# Altium schematic sheet P11 Peripheral of Hi351.SchDoc
size 420 x 297 mm
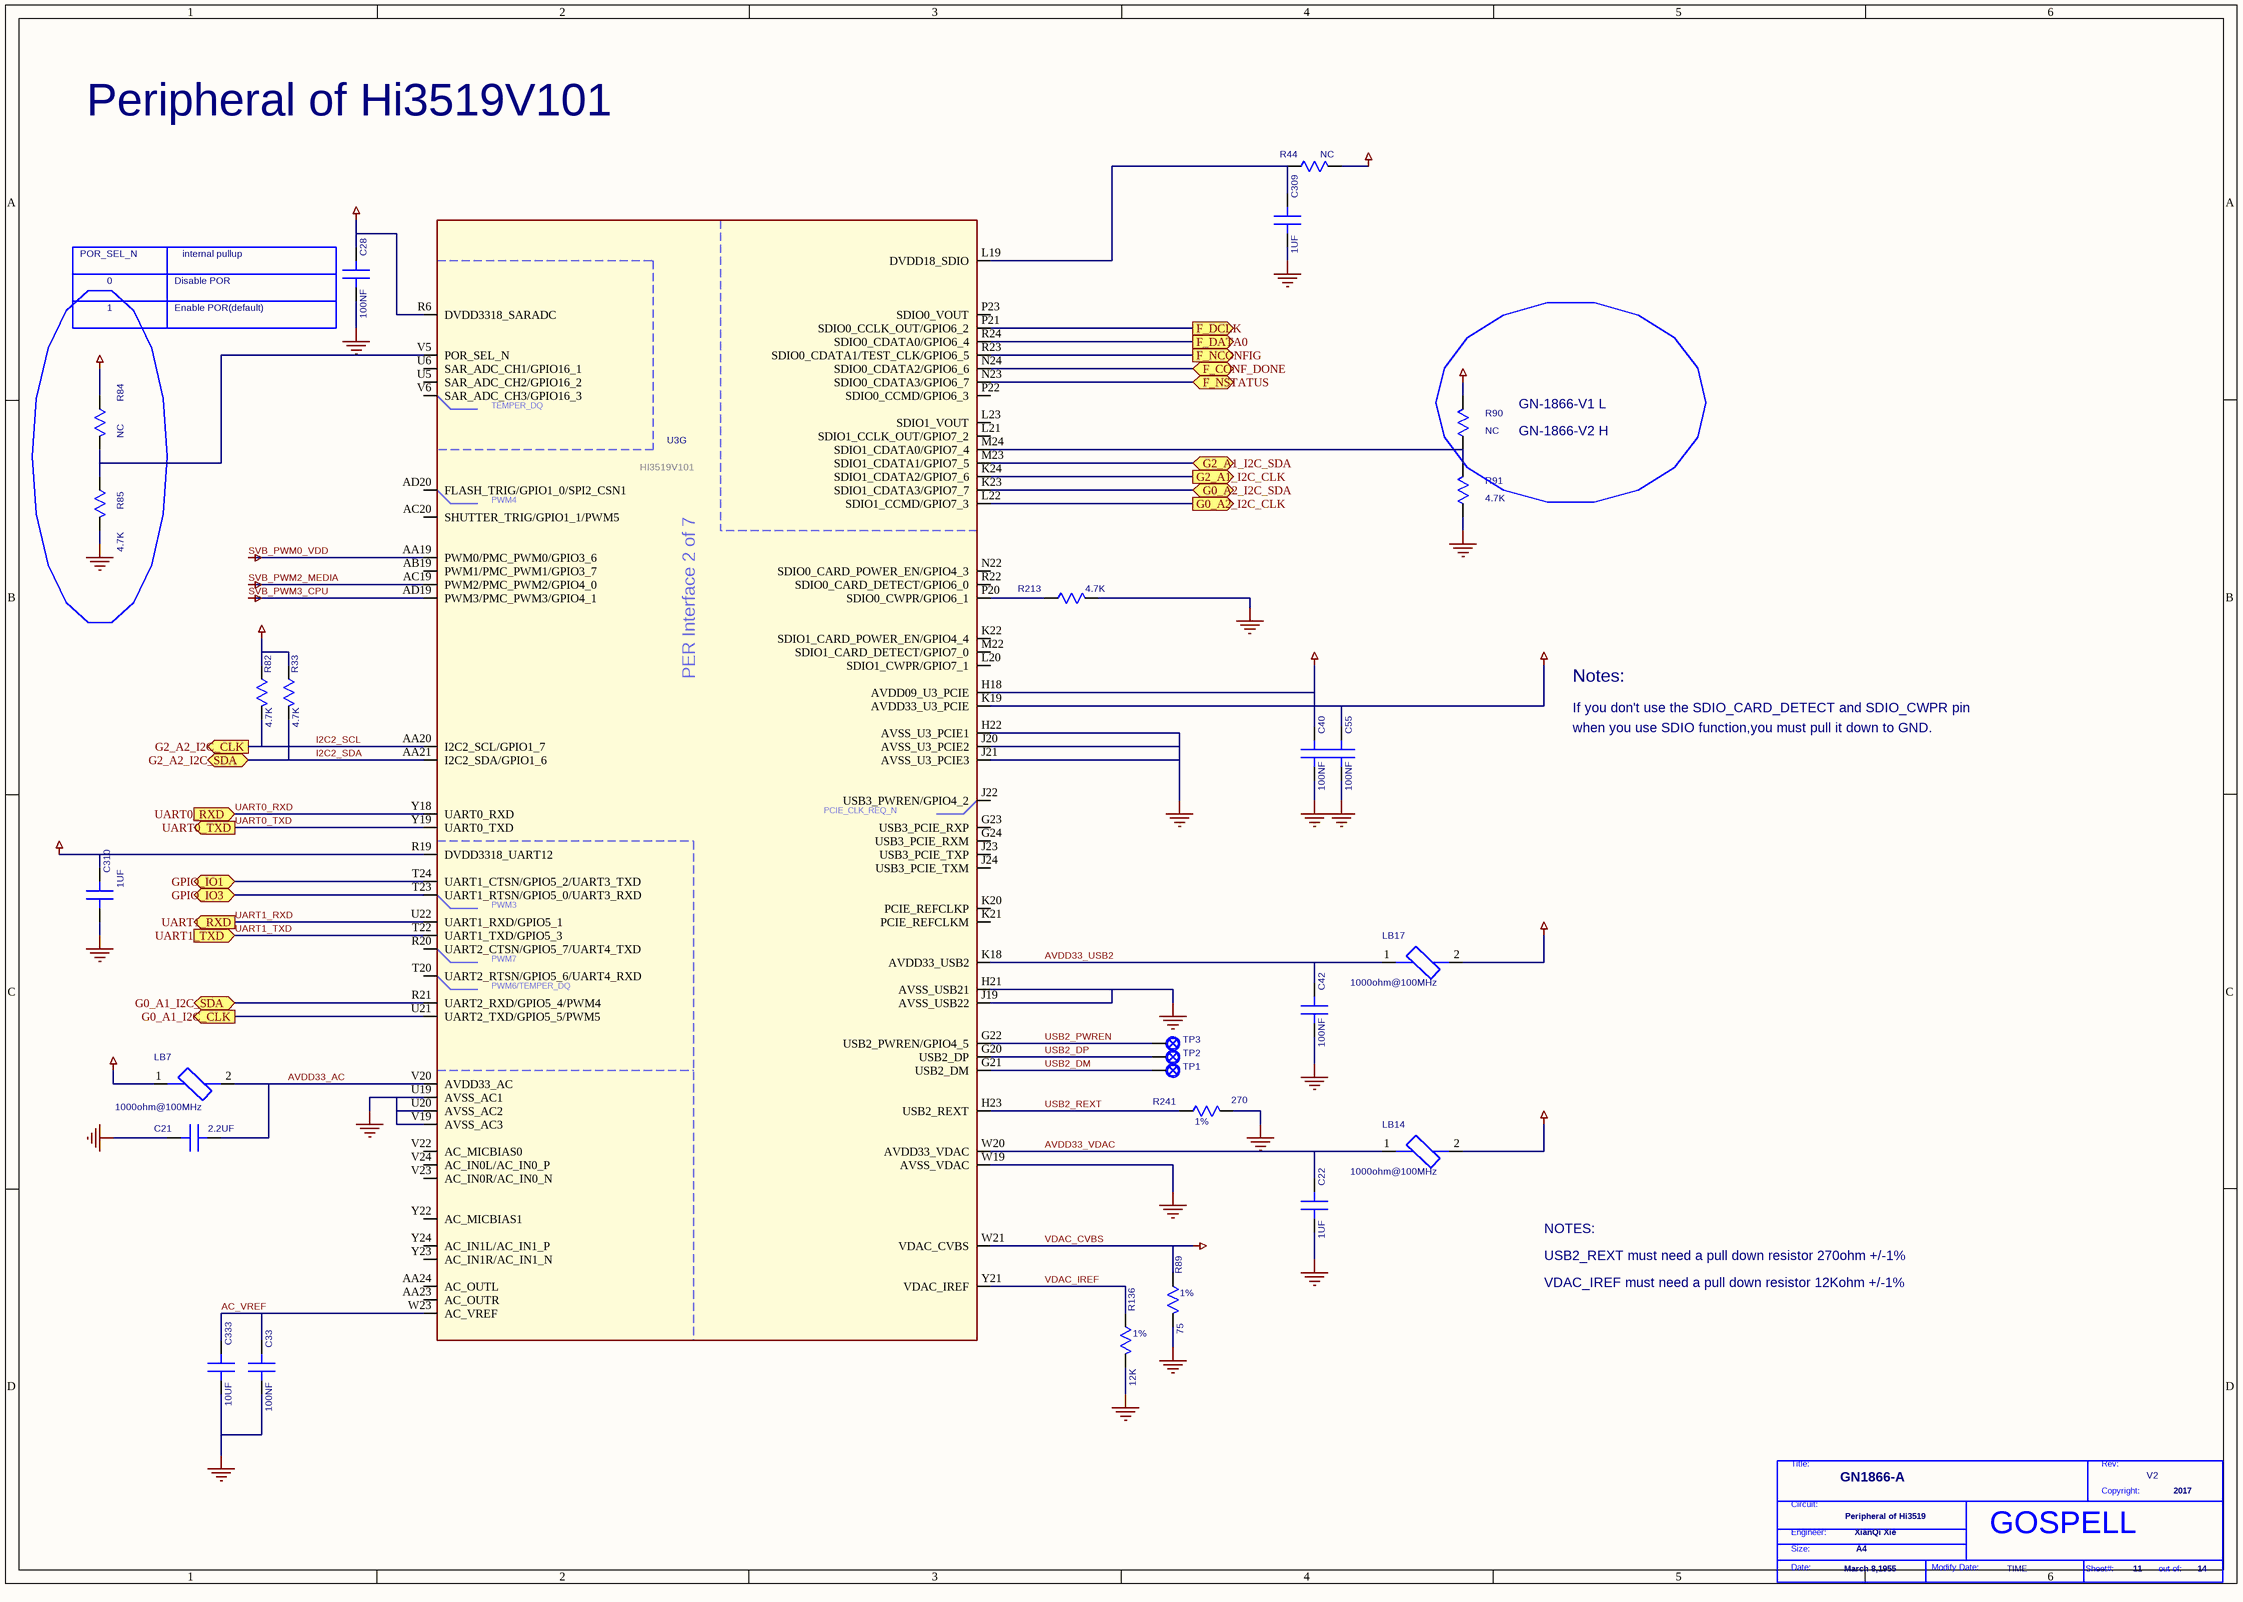
[diagram p0: P11 Peripheral of Hi351.SchDoc]

## Parts
*  Page Modify Date: TIME  Engineer: XianQi Xie  Copyright: 2017  Title: GN1866-A  RevCode: V2  Page Size: A4  Page Create Date: March 8,1955  Page Number: 11  Page Count: 14  Doc: Peripheral of Hi3519  (hidden comment: GOSPELL)  (graphical)
C21  2.2UF  [SC0402]
C22  1UF  [HSC0201]
C28  100NF  [HSC0201]
C33  100NF  [HSC0201]
C40  100NF  [HSC0201]
C42  100NF  [HSC0201]
C55  100NF  [HSC0201]
C309  1UF  [HSC0201]
C310  1UF  [HSC0201]
C333  10UF  [SC0603]
LB7  LB  [HSL0201-TB]  (value not drawn)
LB14  LB  [HSL0201-TB]  (value not drawn)
LB17  LB  [HSL0201-TB]  (value not drawn)
R33  4.7K  [SR0402]
R44  NC  [SR0402]
R82  4.7K  [SR0402]
R84  NC  [SR0402]
R85  4.7K  [SR0402]
R89  75  [SR0402]
R90  NC  [SR0402]
R91  4.7K  [SR0402]
R136  12K  [SR0402]
R213  4.7K  [SR0402]
R241  270  [SC0402]
TP1  TESTPOINT  [TP24-SMD]  (value not drawn)
TP2  TESTPOINT  [TP24-SMD]  (value not drawn)
TP3  TESTPOINT  [TP24-SMD]  (value not drawn)
U3  DEVICE: HI3519V101  [HBGA524-16-2424]  (hidden comment: HI3519V101_PER)  (part G of 7)

## Ports
F_CONF_DONE (bidir), F_DATA0 (out), F_DCLK (out), F_NCONFIG (out), F_NSTATUS (bidir), G0_A1_I2C_CLK (out), G0_A1_I2C_SDA (bidir), G0_A2_I2C_CLK (out), G0_A2_I2C_SDA (bidir), G2_A1_I2C_CLK (out), G2_A1_I2C_SDA (bidir), G2_A2_I2C_CLK (out), G2_A2_I2C_SDA (bidir), GPIO_IO1 (bidir), GPIO_IO3 (bidir), UART0_RXD (in), UART0_TXD (out), UART1_RXD (out), UART1_TXD (in)

## Nets
1V8: R44.2(B)
3V3: C28.2(B) C55.1(A) C310.1(A) LB7.1 LB14.2 LB17.2 R33.1(A) R82.1(A) R84.1(A) R90.2(B) U3.K19(AVDD33_U3_PCIE) U3.R6(DVDD3318_SARADC) U3.R19(DVDD3318_UART12)
GND: C21.1(A) C22.2(B) C28.1(A) C33.2(B) C40.2(B) C42.2(B) C55.2(B) C309.2(B) C310.2(B) C333.2(B) R85.2(B) R89.2(B) R91.1(A) R136.2(B) R213.2(B) R241.2(B) U3.H21(AVSS_USB21) U3.H22(AVSS_U3_PCIE1) U3.J19(AVSS_USB22) U3.J20(AVSS_U3_PCIE2) U3.J21(AVSS_U3_PCIE3) U3.U19(AVSS_AC1) U3.U20(AVSS_AC2) U3.V19(AVSS_AC3) U3.W19(AVSS_VDAC)
SVB_PWM0_VDD: U3.AA19(PWM0/PMC_PWM0/GPIO3_6)
SVB_PWM2_MEDIA: U3.AC19(PWM2/PMC_PWM2/GPIO4_0)
SVB_PWM3_CPU: U3.AD19(PWM3/PMC_PWM3/GPIO4_1)
VCC_VDD_DDR_CORE: C40.1(A) U3.H18(AVDD09_U3_PCIE)
VDAC_CVBS: R89.1(A) U3.W21(VDAC_CVBS)
AC_VREF: C33.1(A) C333.1(A) U3.W23(AC_VREF)
AVDD33_AC: C21.2(B) LB7.2 U3.V20(AVDD33_AC)
AVDD33_USB2: C42.1(A) LB17.1 U3.K18(AVDD33_USB2)
AVDD33_VDAC: C22.1(A) LB14.1 U3.W20(AVDD33_VDAC)
F_CONF_DONE: U3.N24(SDIO0_CDATA2/GPIO6_6) ; port F_CONF_DONE
F_DATA0: U3.R24(SDIO0_CDATA0/GPIO6_4) ; port F_DATA0
F_DCLK: U3.P21(SDIO0_CCLK_OUT/GPIO6_2) ; port F_DCLK
F_NCONFIG: U3.R23(SDIO0_CDATA1/TEST_CLK/GPIO6_5) ; port F_NCONFIG
F_NSTATUS: U3.N23(SDIO0_CDATA3/GPIO6_7) ; port F_NSTATUS
G0_A1_I2C_CLK: U3.U21(UART2_TXD/GPIO5_5/PWM5) ; port G0_A1_I2C_CLK
G0_A1_I2C_SDA: U3.R21(UART2_RXD/GPIO5_4/PWM4) ; port G0_A1_I2C_SDA
G0_A2_I2C_CLK: U3.L22(SDIO1_CCMD/GPIO7_3) ; port G0_A2_I2C_CLK
G0_A2_I2C_SDA: U3.K23(SDIO1_CDATA3/GPIO7_7) ; port G0_A2_I2C_SDA
G2_A1_I2C_CLK: U3.K24(SDIO1_CDATA2/GPIO7_6) ; port G2_A1_I2C_CLK
G2_A1_I2C_SDA: U3.M23(SDIO1_CDATA1/GPIO7_5) ; port G2_A1_I2C_SDA
GPIO_IO1: U3.T24(UART1_CTSN/GPIO5_2/UART3_TXD) ; port GPIO_IO1
GPIO_IO3: U3.T23(UART1_RTSN/GPIO5_0/UART3_RXD) ; port GPIO_IO3
I2C2_SCL: R82.2(B) U3.AA20(I2C2_SCL/GPIO1_7) ; port G2_A2_I2C_CLK
I2C2_SDA: R33.2(B) U3.AA21(I2C2_SDA/GPIO1_6) ; port G2_A2_I2C_SDA
UART0_RXD: U3.Y18(UART0_RXD) ; port UART0_RXD
UART0_TXD: U3.Y19(UART0_TXD) ; port UART0_TXD
UART1_RXD: U3.U22(UART1_RXD/GPIO5_1) ; port UART1_RXD
UART1_TXD: U3.T22(UART1_TXD/GPIO5_3) ; port UART1_TXD
USB2_DM: TP1.1 U3.G21(USB2_DM)
USB2_DP: TP2.1 U3.G20(USB2_DP)
USB2_PWREN: TP3.1 U3.G22(USB2_PWREN/GPIO4_5)
USB2_REXT: R241.1(A) U3.H23(USB2_REXT)
VDAC_IREF: R136.1(A) U3.Y21(VDAC_IREF)
NetC309_1: C309.1(A) R44.1(A) U3.L19(DVDD18_SDIO)
NetR84_2: R84.2(B) R85.1(A) U3.V5(POR_SEL_N)
NetR90_1: R90.1(A) R91.2(B) U3.M24(SDIO1_CDATA0/GPIO7_4)
NetR213_1: R213.1(A) U3.P20(SDIO0_CWPR/GPIO6_1)

Not connected (* = marked no-connect by the designer): U3 AA23(AC_OUTR) AA24(AC_OUTL) AB19(PWM1/PMC_PWM1/GPIO3_7) AC20(SHUTTER_TRIG/GPIO1_1/PWM5) AD20(FLASH_TRIG/GPIO1_0/SPI2_CSN1) G23(USB3_PCIE_RXP) G24(USB3_PCIE_RXM) J22(USB3_PWREN/GPIO4_2) J23(USB3_PCIE_TXP) J24(USB3_PCIE_TXM) K20(PCIE_REFCLKP) K21(PCIE_REFCLKM) K22(SDIO1_CARD_POWER_EN/GPIO4_4) L20(SDIO1_CWPR/GPIO7_1) L21(SDIO1_CCLK_OUT/GPIO7_2) L23(SDIO1_VOUT) M22(SDIO1_CARD_DETECT/GPIO7_0) N22(SDIO0_CARD_POWER_EN/GPIO4_3) P22(SDIO0_CCMD/GPIO6_3) P23(SDIO0_VOUT) R20(UART2_CTSN/GPIO5_7/UART4_TXD) R22(SDIO0_CARD_DETECT/GPIO6_0) T20(UART2_RTSN/GPIO5_6/UART4_RXD) U5(SAR_ADC_CH2/GPIO16_2) U6(SAR_ADC_CH1/GPIO16_1) V6(SAR_ADC_CH3/GPIO16_3) V22(AC_MICBIAS0) V23(AC_IN0R/AC_IN0_N) V24(AC_IN0L/AC_IN0_P) Y22(AC_MICBIAS1) Y23(AC_IN1R/AC_IN1_N) Y24(AC_IN1L/AC_IN1_P)

## Notes on the sheet
- Peripheral of Hi3519V101
- POR_SEL_N
- internal pullup
- 1
- 0
- Enable POR(default)
- Disable POR
- GN-1866-V1 L
- GN-1866-V2 H
- when you use SDIO function,you must pull it down to GND.
- If you don't use the SDIO_CARD_DETECT and SDIO_CWPR pin
- Notes:
- (near LB17) 1000ohm@100MHz
- 1000ohm@100MHz
- (near R241) 1%
- (near LB14) 1000ohm@100MHz
- USB2_REXT must need a pull down resistor 270ohm +/-1%
- NOTES:
- (near R136) 1%
- (near R89) 1%
- VDAC_IREF must need a pull down resistor 12Kohm +/-1%
- (in symbol GOSPELL) Title:; Rev:; Copyright:; Circuit:; Engineer:; Size:; Date:; Modify Date:; Sheet#:; out of:
- (in symbol HI3519V101_PER_2, part G) TEMPER_DQ; PWM4; PER Interface 2 of 7; PCIE_CLK_REQ_N; PWM3; PWM7; PWM6/TEMPER_DQ

## Library data of the parts
C21 = C_0_Dup2: PARTS: 1; OriginalSymbolOrigin: (0,30); DEVICE: GRM155R60J225ME15D; LEVEL: STD; PINSWAP: (A,B); %208%%161%%192%%224%%195%%251%%179%%198%: SMD陶瓷电容; COMPONENT_HIGH_MAX: 0.6MM; %182%%238%%182%%168%%185%%164%%215%%247%%181%%231%%209%%185%(V): 6.3; %195%%232%%202%%246%: SMD陶瓷电容-6.3V-2200NF-+/-20%-X5R-0402-TS16949; CODE: 8070667; GVALUE: C  6.3V  2.2uF +80%~-20%  X5R 0402; PKG_TYPE: SC0402
C22 = C_0_Dup2: PARTS: 1; OriginalSymbolOrigin: (0,30); DEVICE: CM03X5R105M06AH_A; LEVEL: STD; PINSWAP: (A,B); %208%%161%%192%%224%%195%%251%%179%%198%: SMD陶瓷电容; COMPONENT_HIGH_MAX: 0.35MM; %182%%238%%182%%168%%185%%164%%215%%247%%181%%231%%209%%185%(V): 6.3; %195%%232%%202%%246%: SMD陶瓷电容-4V-1000NF-+/-20%-X5R-0201(0.65MM*0.35MM*0.35MM)-终端专用; CODE: 8071128; GVALUE: C  4V  1uF +80%~-20%  X5R 0201(0.65MM*0.35MM*0.35MM); PKG_TYPE: HSC0201
C28 C42 C55 = C_0_Dup2: PARTS: 1; OriginalSymbolOrigin: (0,30); DEVICE: GRM033R60J104KE19D; LEVEL: STD; PINSWAP: (A,B); CODE: 8070704; %195%%232%%202%%246%: SMD陶瓷电容-6.3V-100NF-+/-10%-X5R-0201-TS16949; %182%%238%%182%%168%%185%%164%%215%%247%%181%%231%%209%%185%(V): 6.3; COMPONENT_HIGH_MAX: 0.33MM; %208%%161%%192%%224%%195%%251%%179%%198%: SMD陶瓷电容; GVALUE: C  6.3V  0.1uF +80%~-20%  X5R 0201; PKG_TYPE: HSC0201
C33 C40 = C_0_Dup2: PARTS: 1; OriginalSymbolOrigin: (0,30); DEVICE: GRM033R60J104KE19D; LEVEL: STD; PINSWAP: (A,B); %208%%161%%192%%224%%195%%251%%179%%198%: SMD陶瓷电容; COMPONENT_HIGH_MAX: 0.33MM; %182%%238%%182%%168%%185%%164%%215%%247%%181%%231%%209%%185%(V): 6.3; %195%%232%%202%%246%: SMD陶瓷电容-6.3V-100NF-+/-10%-X5R-0201-TS16949; CODE: 8070704; GVALUE: C  6.3V  0.1uF +80%~-20%  X5R 0201; PKG_TYPE: HSC0201
C309 C310 = C_0_Dup2: PARTS: 1; OriginalSymbolOrigin: (0,30); DEVICE: CM03X5R105M06AH_A; LEVEL: STD; PINSWAP: (A,B); CODE: 8071128; %195%%232%%202%%246%: SMD陶瓷电容-4V-1000NF-+/-20%-X5R-0201(0.65MM*0.35MM*0.35MM)-终端专用; %182%%238%%182%%168%%185%%164%%215%%247%%181%%231%%209%%185%(V): 10; COMPONENT_HIGH_MAX: 0.35MM; %208%%161%%192%%224%%195%%251%%179%%198%: SMD陶瓷电容; GVALUE: C  4V  1uF +80%~-20%  X5R 0201(0.65MM*0.35MM*0.35MM); PKG_TYPE: HSC0201
C333 = C_0_Dup2: PARTS: 1; OriginalSymbolOrigin: (0,30); DEVICE: C1608X5R0J106MT0A0E; LEVEL: STD; PINSWAP: (A,B); CODE: 8070649; %195%%232%%202%%246%: SMD陶瓷电容-6.3V-10000NF-+/-20%-X5R-0603-BT,TS16949; %182%%238%%182%%168%%185%%164%%215%%247%%181%%231%%209%%185%(V): 6.3; COMPONENT_HIGH_MAX: 0.9MM; %208%%161%%192%%224%%195%%251%%179%%198%: SMD陶瓷电容; GVALUE: C  6.3V  10uF +80%~-20%  X5R 0603; PKG_TYPE: SC0603
LB7 LB14 LB17 = LB_0: PARTS: 1; OriginalSymbolOrigin: (20,50); LEVEL: STD; DEVICE: NOOO; %195%%232%%202%%246%: EMI磁珠-+/-25%-1000OHM-1.25OHM-0.25A-0402-1400OHM@1GHZ; COMPONENT_HIGH_MAX: 0.65MM; %208%%161%%192%%224%%195%%251%%179%%198%: EMI磁珠; GVALUE: 麦捷:0201磁珠80欧; PKG_TYPE: HSL0201-TB
R33 R85 R213 = R_0: PARTS: 1; OriginalSymbolOrigin: (10,20); PINSWAP: (A,B); DEVICE: RK73B1ELTP472J; LEVEL: STD; CODE: 7090793; %195%%232%%202%%246%: 片式厚膜电阻器-0.0625W-4700OHM-+/-5%-0402-BT; %182%%238%%182%%168%%185%%166%%194%%202%(W): 0.06; %215%%232%%214%%181%%212%%202%%208%%237%%198%%171%%178%%238%: +/-5%; COMPONENT_HIGH_MAX: 0.4MM; %208%%161%%192%%224%%195%%251%%179%%198%: 片式厚膜电阻器; GVALUE: R 1/16W 4.7K±5% 0402; PKG_TYPE: SR0402
R44 R90 = R_0: PARTS: 1; OriginalSymbolOrigin: (10,20); PINSWAP: (A,B); DEVICE: RC0603JR_07300K; PKG_TYPE: SR0603; LEVEL: STD; %208%%161%%192%%224%%195%%251%%179%%198%: 片式厚膜电阻器; COMPONENT_HIGH_MAX: 0.55MM; %215%%232%%214%%181%%212%%202%%208%%237%%198%%171%%178%%238%: +/-5%; %182%%238%%182%%168%%185%%166%%194%%202%(W): 0.1; %195%%232%%202%%246%: 片式厚膜电阻器-0.1W-300000OHM-+/-5%-0603; CODE: 7090261; GVALUE: NC
R82 = R_0: PARTS: 1; OriginalSymbolOrigin: (10,20); PINSWAP: (A,B); DEVICE: RK73B1ELTP472J; LEVEL: STD; %208%%161%%192%%224%%195%%251%%179%%198%: 片式厚膜电阻器; COMPONENT_HIGH_MAX: 0.4MM; %215%%232%%214%%181%%212%%202%%208%%237%%198%%171%%178%%238%: +/-5%; %182%%238%%182%%168%%185%%166%%194%%202%(W): 0.06; %195%%232%%202%%246%: 片式厚膜电阻器-0.0625W-4700OHM-+/-5%-0402-BT; CODE: 7090793; GVALUE: R 1/16W 4.7K±5% 0402; PKG_TYPE: SR0402
R84 = R_0: PARTS: 1; OriginalSymbolOrigin: (10,20); PINSWAP: (A,B); DEVICE: RK73B1ELTP472J; LEVEL: STD; CODE: 7090793; %195%%232%%202%%246%: 片式厚膜电阻器-0.0625W-4700OHM-+/-5%-0402-BT; %182%%238%%182%%168%%185%%166%%194%%202%(W): 0.06; %215%%232%%214%%181%%212%%202%%208%%237%%198%%171%%178%%238%: +/-5%; COMPONENT_HIGH_MAX: 0.4MM; %208%%161%%192%%224%%195%%251%%179%%198%: 片式厚膜电阻器; PKG_TYPE: SR0402; GVALUE: NC
R89 = R_0: PARTS: 1; OriginalSymbolOrigin: (10,20); PINSWAP: (A,B); DEVICE: RC_02W750FT; LEVEL: STD; %208%%161%%192%%224%%195%%251%%179%%198%: 片式厚膜电阻器; COMPONENT_HIGH_MAX: 0.4MM; %215%%232%%214%%181%%212%%202%%208%%237%%198%%171%%178%%238%: +/-1%; %182%%238%%182%%168%%185%%166%%194%%202%(W): 0.06; %195%%232%%202%%246%: 片式厚膜电阻器-0.0625W-75OHM-+/-1%-0402; CODE: 7091321; GVALUE: R 1/16W 75±5% 0402; PKG_TYPE: SR0402
R91 = R_0: PARTS: 1; OriginalSymbolOrigin: (10,20); PINSWAP: (A,B); DEVICE: RC0603JR_07300K; PKG_TYPE: SR0603; LEVEL: STD; CODE: 7090261; %195%%232%%202%%246%: 片式厚膜电阻器-0.1W-300000OHM-+/-5%-0603; %182%%238%%182%%168%%185%%166%%194%%202%(W): 0.1; %215%%232%%214%%181%%212%%202%%208%%237%%198%%171%%178%%238%: +/-5%; COMPONENT_HIGH_MAX: 0.55MM; %208%%161%%192%%224%%195%%251%%179%%198%: 片式厚膜电阻器; GVALUE: R 1/16W 4.7K±5% 0402
R136 = R_0: PARTS: 1; OriginalSymbolOrigin: (10,20); PINSWAP: (A,B); DEVICE: RC0402FR_0712K; LEVEL: STD; CODE: 7090817; %195%%232%%202%%246%: 片式厚膜电阻器-0.0625W-12000OHM-+/-1%-0402; %182%%238%%182%%168%%185%%166%%194%%202%(W): 0.06; %215%%232%%214%%181%%212%%202%%208%%237%%198%%171%%178%%238%: +/-1%; COMPONENT_HIGH_MAX: 0.4MM; %208%%161%%192%%224%%195%%251%%179%%198%: 片式厚膜电阻器; GVALUE: R 1/16W 12K±5% 0402; PKG_TYPE: SR0402
R241 = R_0: PARTS: 1; OriginalSymbolOrigin: (10,20); PINSWAP: (A,B); DEVICE: RC0603FR_07270R; PKG_TYPE: SR0603; LEVEL: STD; %208%%161%%192%%224%%195%%251%%179%%198%: 片式厚膜电阻器; COMPONENT_HIGH_MAX: 0.55MM; %215%%232%%214%%181%%212%%202%%208%%237%%198%%171%%178%%238%: +/-1%; %182%%238%%182%%168%%185%%166%%194%%202%(W): 0.1; %195%%232%%202%%246%: 片式厚膜电阻器-0.1W-270OHM-+/-1%-0603-TS16949; CODE: 7090602; GVALUE: R 1/16W 270±1% 0402
TP1-TP3 = TESTPOINT_0: PARTS: 1; OriginalSymbolOrigin: (20,20); LEVEL: STD; DEVICE: TEST-SMD; GVALUE: NC; PKG_TYPE: TP24-SMD
U3 = HI3519V101_PER_2: PARTS: 1; OriginalSymbolOrigin: (0,840); LEVEL: STD; HETERO: (HI3519V101_PWR),(HI3519V101_DDR),(HI3519V101_SYS),(HI3519V101_VIVO),(HI3519V101_PER),(HI3519V101_VSS1),(HI3519V101_VSS2); CaptureCellPackProp: HI3519V101_PERG; COMPONENT_HIGH_MAX: 0.98MM; %195%%232%%202%%246%: 请注意是HDI板，建库的时候请注意下-02323838; CODE: G01428016_MODZH; FORWARD_PCB: 1; PKG_TYPE: HBGA524-16-2424; GVALUE: HI3519V101_PER
* = GOSPELL: Cage Code: 2017